# Altium schematic sheet FPGA.SchDoc
size A3; SheetNumber: 2; SheetTotal: 7
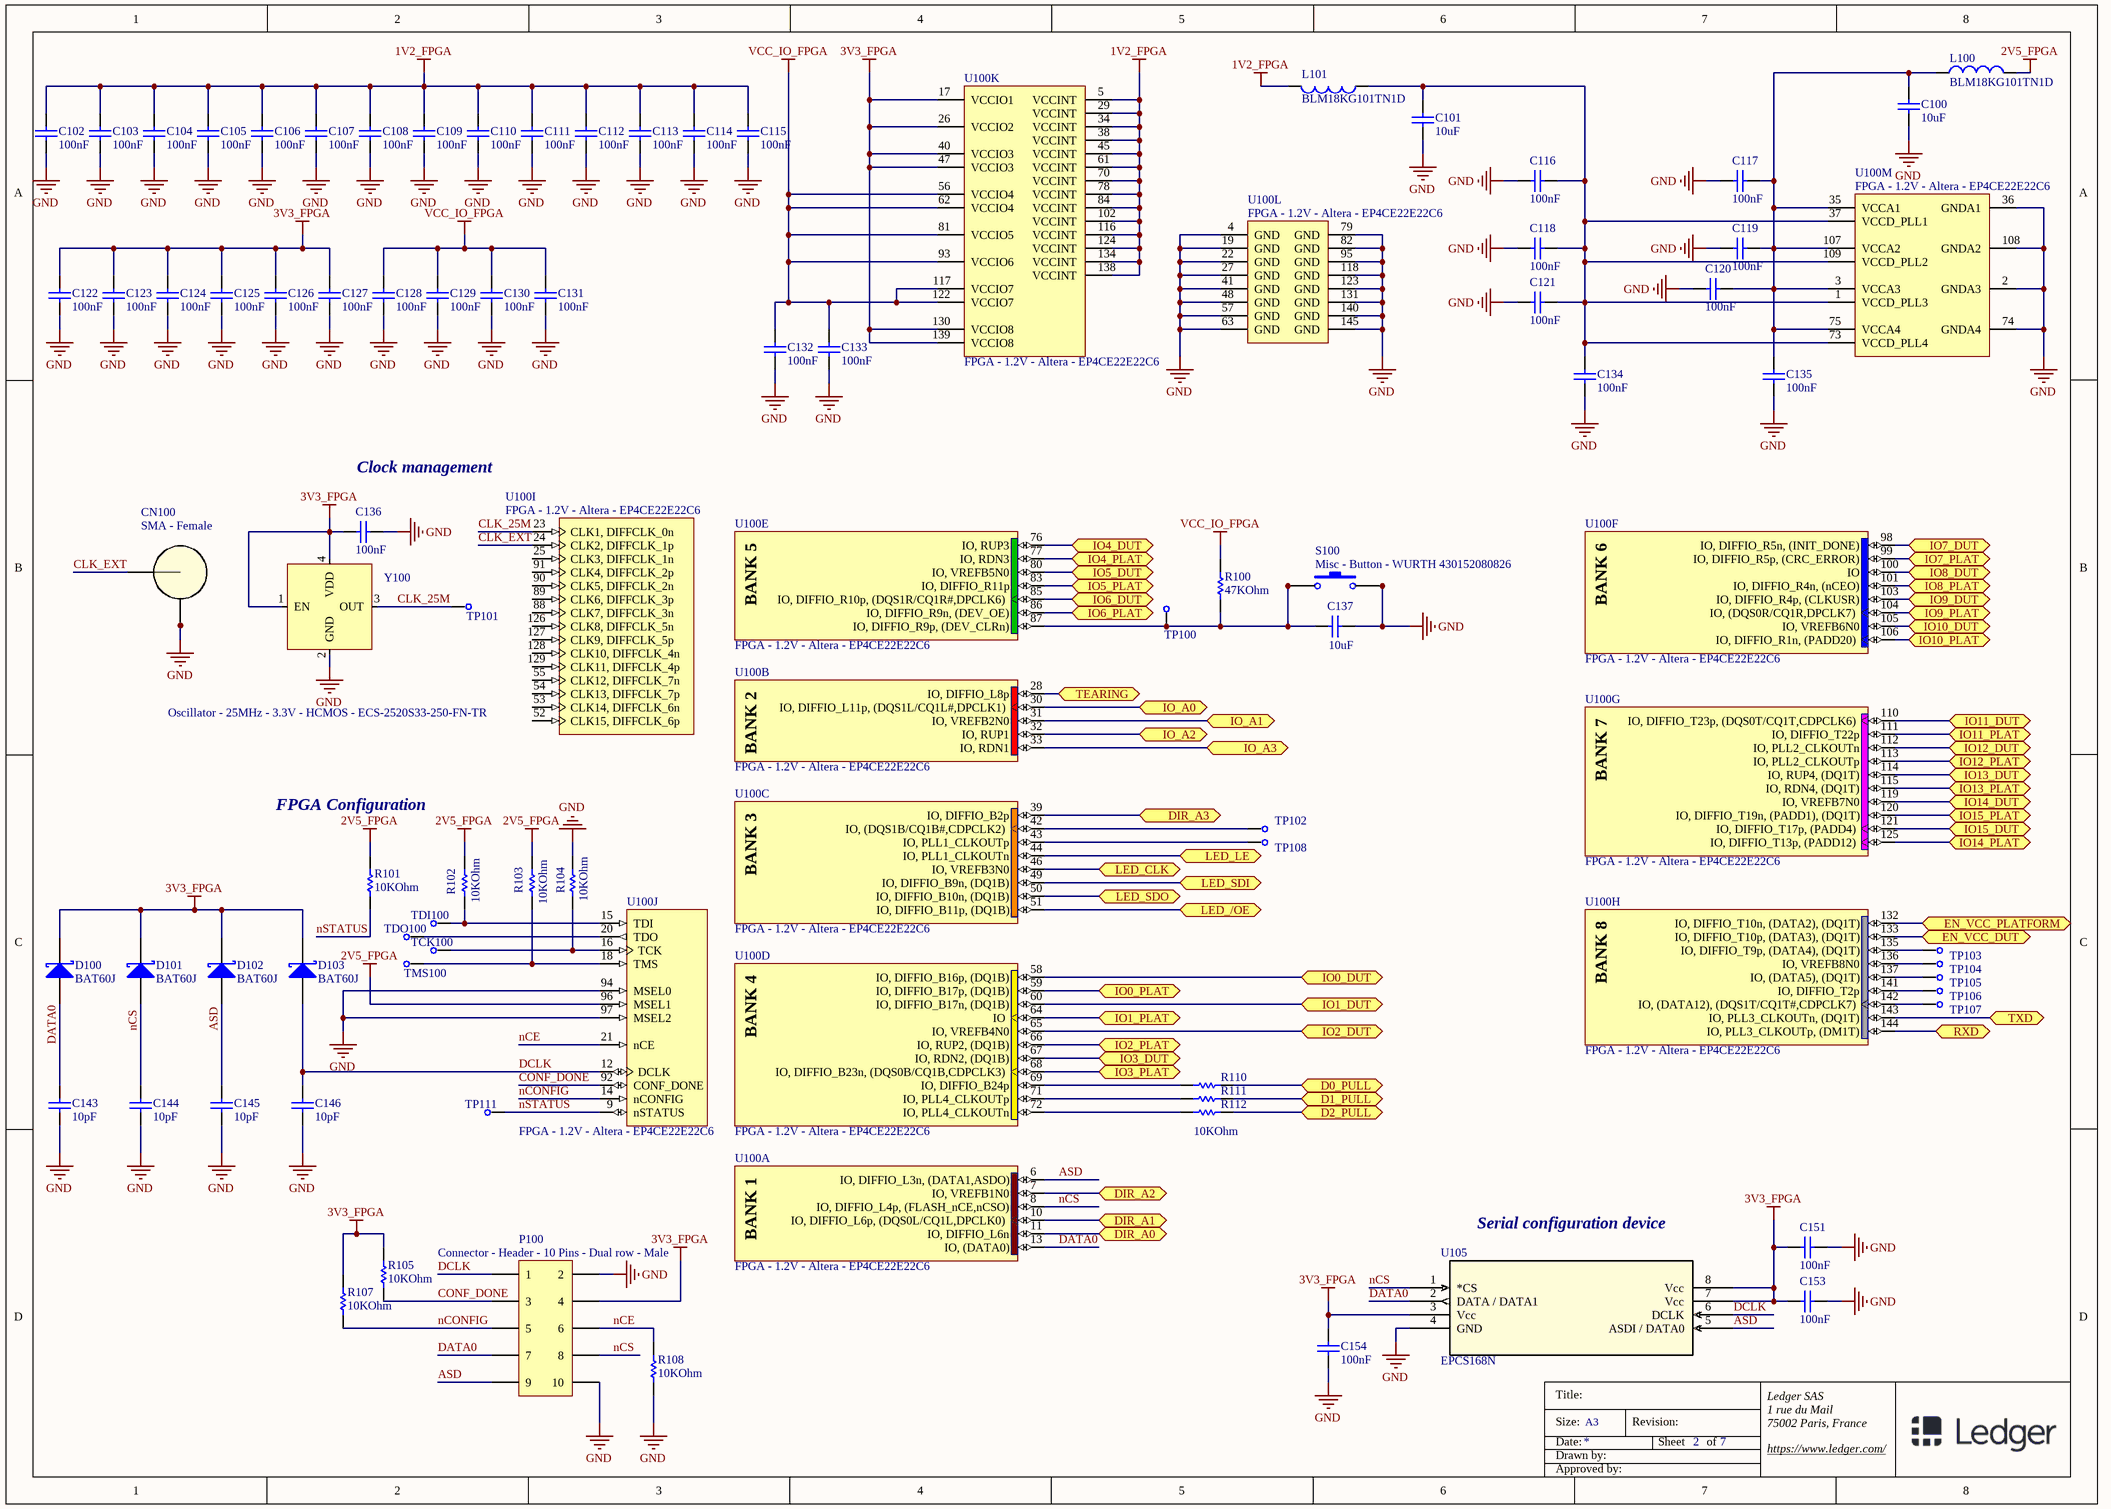
[diagram p0: FPGA.SchDoc]

## Parts
C100  10uF  [CAP0603]
C101  10uF  [CAP0603]
C102  100nF  [CAP0603]
C103  100nF  [CAP0603]
C104  100nF  [CAP0603]
C105  100nF  [CAP0603]
C106  100nF  [CAP0603]
C107  100nF  [CAP0603]
C108  100nF  [CAP0603]
C109  100nF  [CAP0603]
C110  100nF  [CAP0603]
C111  100nF  [CAP0603]
C112  100nF  [CAP0603]
C113  100nF  [CAP0603]
C114  100nF  [CAP0603]
C115  100nF  [CAP0603]
C116  100nF  [CAP0603]
C117  100nF  [CAP0603]
C118  100nF  [CAP0603]
C119  100nF  [CAP0603]
C120  100nF  [CAP0603]
C121  100nF  [CAP0603]
C122  100nF  [CAP0603]
C123  100nF  [CAP0603]
C124  100nF  [CAP0603]
C125  100nF  [CAP0603]
C126  100nF  [CAP0603]
C127  100nF  [CAP0603]
C128  100nF  [CAP0603]
C129  100nF  [CAP0603]
C130  100nF  [CAP0603]
C131  100nF  [CAP0603]
C132  100nF  [CAP0603]
C133  100nF  [CAP0603]
C134  100nF  [CAP0603]
C135  100nF  [CAP0603]
C136  100nF  [CAP0603]
C137  10uF  [CAP0603]
C143  10pF  [CAP0603]
C144  10pF  [CAP0603]
C145  10pF  [CAP0603]
C146  10pF  [CAP0603]
C151  100nF  [CAP0603]
C153  100nF  [CAP0603]
C154  100nF  [CAP0603]
CN100  SMA - Female  [SAMTEC_SMA-J-P-X-ST-EM3]
D100  BAT60J  [SOD323/A]
D101  BAT60J  [SOD323/A]
D102  BAT60J  [SOD323/A]
D103  BAT60J  [SOD323/A]
L100  BLM18KG101TN1D  [0603]
L101  BLM18KG101TN1D  [0603]
P100  Connector - Header - 10 Pins - Dual row - Male  [SAMTEC_TSW-105-07-G-D]
R100  47KOhm  [RES0603]
R101  10KOhm  [RES0603]
R102  10KOhm  [RES0603]
R103  10KOhm  [RES0603]
R104  10KOhm  [RES0603]
R105  10KOhm  [RES0603]
R107  10KOhm  [RES0603]
R108  10KOhm  [RES0603]
R110  10KOhm  [RES0603]  (value not drawn)
R111  10KOhm  [RES0603]  (value not drawn)
R112  10KOhm  [RES0603]
S100  Misc - Button - WURTH 430152080826  [430152080826]
TCK100  (no value)  [TP_001]  (no BOM)
TDI100  (no value)  [TP_001]  (no BOM)
TDO100  (no value)  [TP_001]  (no BOM)
TMS100  (no value)  [TP_001]  (no BOM)
TP100  (no value)  [TP_001]  (no BOM)
TP101  (no value)  [TP_001]  (no BOM)
TP102  (no value)  [TP_001]  (no BOM)
TP103  (no value)  [TP_001]  (no BOM)
TP104  (no value)  [TP_001]  (no BOM)
TP105  (no value)  [TP_001]  (no BOM)
TP106  (no value)  [TP_001]  (no BOM)
TP107  (no value)  [TP_001]  (no BOM)
TP108  (no value)  [TP_001]  (no BOM)
TP111  (no value)  [TP_001]  (no BOM)
U100  FPGA - 1.2V - Altera - EP4CE22E22C6  [EQFP144_M]  (parts A,B,C,D,E,F,G,H,I,J,K,L,M of 13)
U105  EPCS168N  [8-SOIC-M]
Y100  Oscillator - 25MHz - 3.3V - HCMOS - ECS-2520S33-250-FN-TR  [XTAL_2520]

## Ports
D0_PULL, D1_PULL, D2_PULL, DIR_A0, DIR_A1, DIR_A2, DIR_A3, EN_VCC_DUT, EN_VCC_PLATFORM, IO0_DUT, IO0_PLAT, IO1_DUT, IO1_PLAT, IO2_DUT, IO2_PLAT, IO3_DUT, IO3_PLAT, IO4_DUT, IO4_PLAT, IO5_DUT, IO5_PLAT, IO6_DUT, IO6_PLAT, IO7_DUT, IO7_PLAT, IO8_DUT, IO8_PLAT, IO9_DUT, IO9_PLAT, IO10_DUT, IO10_PLAT, IO11_DUT, IO11_PLAT, IO12_DUT, IO12_PLAT, IO13_DUT, IO13_PLAT, IO14_DUT, IO14_PLAT, IO15_DUT, IO15_PLAT, IO_A0, IO_A1, IO_A2, IO_A3, LED_/OE, LED_CLK, LED_LE, LED_SDI, LED_SDO, RXD, TEARING, TXD

## Nets
1V2_FPGA: C102.2 C103.2 C104.2 C105.2 C106.2 C107.2 C108.2 C109.2 C110.2 C111.2 C112.2 C113.2 C114.2 C115.2 L101.2 U100.5(VCCINT) U100.29(VCCINT) U100.34(VCCINT) U100.38(VCCINT) U100.45(VCCINT) U100.61(VCCINT) U100.70(VCCINT) U100.78(VCCINT) U100.84(VCCINT) U100.102(VCCINT) U100.116(VCCINT) U100.124(VCCINT) U100.134(VCCINT) U100.138(VCCINT)
2V5_FPGA: L100.2 R101.2 R102.2 R103.2 U100.96(MSEL1)
3V3_FPGA: C122.2 C123.2 C124.2 C125.2 C126.2 C127.2 C136.1 C151.2 C153.2 C154.2 D100.2(K) D101.2(K) D102.2(K) D103.2(K) P100.4 R105.2 R107.2 U100.17(VCCIO1) U100.26(VCCIO2) U100.40(VCCIO3) U100.47(VCCIO3) U100.130(VCCIO8) U100.139(VCCIO8) U105.3(Vcc) U105.7(Vcc) U105.8(Vcc) Y100.1(EN) Y100.4(VDD)
GND: C100.1 C101.1 C102.1 C103.1 C104.1 C105.1 C106.1 C107.1 C108.1 C109.1 C110.1 C111.1 C112.1 C113.1 C114.1 C115.1 C116.1 C117.1 C118.1 C119.1 C120.1 C121.1 C122.1 C123.1 C124.1 C125.1 C126.1 C127.1 C128.1 C129.1 C130.1 C131.1 C132.1 C133.1 C134.1 C135.1 C136.2 C137.1 C143.1 C144.1 C145.1 C146.1 C151.1 C153.1 C154.1 CN100.2 CN100.3 P100.2 P100.10 R104.2 R108.1 S100.2 S100.4 U100.2(GNDA3) U100.4(GND) U100.19(GND) U100.22(GND) U100.27(GND) U100.36(GNDA1) U100.41(GND) U100.48(GND) U100.57(GND) U100.63(GND) U100.74(GNDA4) U100.79(GND) U100.82(GND) U100.94(MSEL0) U100.95(GND) U100.97(MSEL2) U100.108(GNDA2) U100.118(GND) U100.123(GND) U100.131(GND) U100.140(GND) U100.145(GND) U105.4(GND) Y100.2(GND)
VCC_IO_FPGA: C128.2 C129.2 C130.2 C131.2 C132.2 C133.2 R100.2 U100.56(VCCIO4) U100.62(VCCIO4) U100.81(VCCIO5) U100.93(VCCIO6) U100.117(VCCIO7) U100.122(VCCIO7)
ASD: C145.2 D102.1(A) P100.9 U100.6(IO,_DIFFIO_L3n,_(DATA1,ASDO)) U105.5(ASDI_/_DATA0)
CLK_25M: TP101.1 U100.23(CLK1,_DIFFCLK_0n) Y100.3(OUT)
CLK_EXT: CN100.1 U100.24(CLK2,_DIFFCLK_1p)
CONF_DONE: P100.3 R105.1 U100.92(CONF_DONE)
D0_PULL: R110.2 ; port D0_PULL
D1_PULL: R111.2 ; port D1_PULL
D2_PULL: R112.1 ; port D2_PULL
DATA0: C143.2 D100.1(A) P100.7 U100.13(IO,_(DATA0)) U105.2(DATA_/_DATA1)
DCLK: C146.2 D103.1(A) P100.1 U100.12(DCLK) U105.6(DCLK)
DIR_A0: U100.11(IO,_DIFFIO_L6n) ; port DIR_A0
DIR_A1: U100.10(IO,_DIFFIO_L6p,_(DQS0L/CQ1L,DPCLK0)) ; port DIR_A1
DIR_A2: U100.7(IO,_VREFB1N0) ; port DIR_A2
DIR_A3: U100.39(IO,_DIFFIO_B2p) ; port DIR_A3
EN_VCC_DUT: U100.133(IO,_DIFFIO_T10p,_(DATA3),_(DQ1T)) ; port EN_VCC_DUT
EN_VCC_PLATFORM: U100.132(IO,_DIFFIO_T10n,_(DATA2),_(DQ1T)) ; port EN_VCC_PLATFORM
IO0_DUT: U100.58(IO,_DIFFIO_B16p,_(DQ1B)) ; port IO0_DUT
IO0_PLAT: U100.59(IO,_DIFFIO_B17p,_(DQ1B)) ; port IO0_PLAT
IO1_DUT: U100.60(IO,_DIFFIO_B17n,_(DQ1B)) ; port IO1_DUT
IO1_PLAT: U100.64(IO) ; port IO1_PLAT
IO2_DUT: U100.65(IO,_VREFB4N0) ; port IO2_DUT
IO2_PLAT: U100.66(IO,_RUP2,_(DQ1B)) ; port IO2_PLAT
IO3_DUT: U100.67(IO,_RDN2,_(DQ1B)) ; port IO3_DUT
IO3_PLAT: U100.68(IO,_DIFFIO_B23n,_(DQS0B/CQ1B,CDPCLK3)) ; port IO3_PLAT
IO4_DUT: U100.76(IO,_RUP3) ; port IO4_DUT
IO4_PLAT: U100.77(IO,_RDN3) ; port IO4_PLAT
IO5_DUT: U100.80(IO,_VREFB5N0) ; port IO5_DUT
IO5_PLAT: U100.83(IO,_DIFFIO_R11p) ; port IO5_PLAT
IO6_DUT: U100.85(IO,_DIFFIO_R10p,_(DQS1R/CQ1R#,DPCLK6)) ; port IO6_DUT
IO6_PLAT: U100.86(IO,_DIFFIO_R9n,_(DEV_OE)) ; port IO6_PLAT
IO7_DUT: U100.98(IO,_DIFFIO_R5n,_(INIT_DONE)) ; port IO7_DUT
IO7_PLAT: U100.99(IO,_DIFFIO_R5p,_(CRC_ERROR)) ; port IO7_PLAT
IO8_DUT: U100.100(IO) ; port IO8_DUT
IO8_PLAT: U100.101(IO,_DIFFIO_R4n,_(nCEO)) ; port IO8_PLAT
IO9_DUT: U100.103(IO,_DIFFIO_R4p,_(CLKUSR)) ; port IO9_DUT
IO9_PLAT: U100.104(IO,_(DQS0R/CQ1R,DPCLK7)) ; port IO9_PLAT
IO10_DUT: U100.105(IO,_VREFB6N0) ; port IO10_DUT
IO10_PLAT: U100.106(IO,_DIFFIO_R1n,_(PADD20)) ; port IO10_PLAT
IO11_DUT: U100.110(IO,_DIFFIO_T23p,_(DQS0T/CQ1T,CDPCLK6)) ; port IO11_DUT
IO11_PLAT: U100.111(IO,_DIFFIO_T22p) ; port IO11_PLAT
IO12_DUT: U100.112(IO,_PLL2_CLKOUTn) ; port IO12_DUT
IO12_PLAT: U100.113(IO,_PLL2_CLKOUTp) ; port IO12_PLAT
IO13_DUT: U100.114(IO,_RUP4,_(DQ1T)) ; port IO13_DUT
IO13_PLAT: U100.115(IO,_RDN4,_(DQ1T)) ; port IO13_PLAT
IO14_DUT: U100.119(IO,_VREFB7N0) ; port IO14_DUT
IO14_PLAT: U100.125(IO,_DIFFIO_T13p,_(PADD12)) ; port IO14_PLAT
IO15_DUT: U100.121(IO,_DIFFIO_T17p,_(PADD4)) ; port IO15_DUT
IO15_PLAT: U100.120(IO,_DIFFIO_T19n,_(PADD1),_(DQ1T)) ; port IO15_PLAT
IO_A0: U100.30(IO,_DIFFIO_L11p,_(DQS1L/CQ1L#,DPCLK1)) ; port IO_A0
IO_A1: U100.31(IO,_VREFB2N0) ; port IO_A1
IO_A2: U100.32(IO,_RUP1) ; port IO_A2
IO_A3: U100.33(IO,_RDN1) ; port IO_A3
LED_/OE: U100.51(IO,_DIFFIO_B11p,_(DQ1B)) ; port LED_/OE
LED_CLK: U100.46(IO,_VREFB3N0) ; port LED_CLK
LED_LE: U100.44(IO,_PLL1_CLKOUTn) ; port LED_LE
LED_SDI: U100.49(IO,_DIFFIO_B9n,_(DQ1B)) ; port LED_SDI
LED_SDO: U100.50(IO,_DIFFIO_B10n,_(DQ1B)) ; port LED_SDO
nCE: P100.6 R108.2 U100.21(nCE)
nCONFIG: P100.5 R107.1 U100.14(nCONFIG)
nCS: C144.2 D101.1(A) P100.8 U100.8(IO,_DIFFIO_L4p,_(FLASH_nCE,nCSO)) U105.1(*CS)
nSTATUS: R101.1 TP111.1 U100.9(nSTATUS)
RXD: U100.144(IO,_PLL3_CLKOUTp,_(DM1T)) ; port RXD
TEARING: U100.28(IO,_DIFFIO_L8p) ; port TEARING
TXD: U100.143(IO,_PLL3_CLKOUTn,_(DQ1T)) ; port TXD
NetC100_2: C100.2 C117.2 C119.2 C120.2 C135.2 L100.1 U100.3(VCCA3) U100.35(VCCA1) U100.75(VCCA4) U100.107(VCCA2)
NetC101_2: C101.2 C116.2 C118.2 C121.2 C134.2 L101.1 U100.1(VCCD_PLL3) U100.37(VCCD_PLL1) U100.73(VCCD_PLL4) U100.109(VCCD_PLL2)
NetC137_2: C137.2 R100.1 S100.1 S100.3 TP100.1 U100.87(IO,_DIFFIO_R9p,_(DEV_CLRn))
NetR102_1: R102.1 TDI100.1 U100.15(TDI)
NetR103_1: R103.1 TMS100.1 U100.18(TMS)
NetR104_1: R104.1 TCK100.1 U100.16(TCK)
NetR110_1: R110.1 U100.69(IO,_DIFFIO_B24p)
NetR111_1: R111.1 U100.71(IO,_PLL4_CLKOUTp)
NetR112_2: R112.2 U100.72(IO,_PLL4_CLKOUTn)
NetTDO100_1: TDO100.1 U100.20(TDO)
NetTP102_1: TP102.1 U100.42(IO,_(DQS1B/CQ1B#,CDPCLK2))
NetTP103_1: TP103.1 U100.135(IO,_DIFFIO_T9p,_(DATA4),_(DQ1T))
NetTP104_1: TP104.1 U100.136(IO,_VREFB8N0)
NetTP105_1: TP105.1 U100.137(IO,_(DATA5),_(DQ1T))
NetTP106_1: TP106.1 U100.141(IO,_DIFFIO_T2p)
NetTP107_1: TP107.1 U100.142(IO,_(DATA12),_(DQS1T/CQ1T#,CDPCLK7))
NetTP108_1: TP108.1 U100.43(IO,_PLL1_CLKOUTp)

Not connected (* = marked no-connect by the designer): U100 25(CLK3,_DIFFCLK_1n) 52(CLK15,_DIFFCLK_6p) 53(CLK14,_DIFFCLK_6n) 54(CLK13,_DIFFCLK_7p) 55(CLK12,_DIFFCLK_7n) 88(CLK7,_DIFFCLK_3n) 89(CLK6,_DIFFCLK_3p) 90(CLK5,_DIFFCLK_2n) 91(CLK4,_DIFFCLK_2p) 126(CLK8,_DIFFCLK_5n) 127(CLK9,_DIFFCLK_5p) 128(CLK10,_DIFFCLK_4n) 129(CLK11,_DIFFCLK_4p)

## Notes on the sheet
- Clock management
- FPGA Configuration
- Serial configuration device
- Title:
- Size:
- Date:
- Drawn by:
- A3
- Revision:
- Sheet
- of
- Ledger SAS
- 1 rue du Mail
- 75002 Paris, France
- https://www.ledger.com/
- Approved by:
- (in symbol FPGA - 1.2V - Altera - EP4CE22E22C6, part A) BANK 1
- (in symbol FPGA - 1.2V - Altera - EP4CE22E22C6, part B) BANK 2
- (in symbol FPGA - 1.2V - Altera - EP4CE22E22C6, part C) BANK 3
- (in symbol FPGA - 1.2V - Altera - EP4CE22E22C6, part D) BANK 4
- (in symbol FPGA - 1.2V - Altera - EP4CE22E22C6, part E) BANK 5
- (in symbol FPGA - 1.2V - Altera - EP4CE22E22C6, part F) BANK 6
- (in symbol FPGA - 1.2V - Altera - EP4CE22E22C6, part G) BANK 7
- (in symbol FPGA - 1.2V - Altera - EP4CE22E22C6, part H) BANK 8

## Library data of the parts
C100 C101 C137 = Capacitor 0603 - 10uF - 16V - X5R - 20%: Manufacturer: Murata; Manufacturer PN: GRM188R61C106MA73D; Manufacturer1: TDK; Manufacturer1 PN: C1608X5R1C106M080AB; Manufacturer2 PN: EMK107BBJ106MA-T; PkgCode: 0603; value: 10uF; Type: X5R; Tolerance: 20%; Power: 16V; Manufacturer2: Taiyo Yuden
C102-C135 C151 C153 C154 = Capacitor 0603 - 100nF - 16V - X7R - 10%: Manufacturer2 PN: MCCA000159; Manufacturer1: Yageo; Manufacturer1 PN: CC0603KRX7R7BB104; Manufacturer: Wurth; Manufacturer PN: 885012206046; PkgCode: 0603; Manufacturer2: Multicomp; Value: 100nF; Power: 16V; Tolerance: 10%; Type: X7R
C136 = Capacitor 0603 - 100nF - 16V - X7R - 10%: Manufacturer: Wurth; Manufacturer PN: 885012206046; Manufacturer1: Yageo; Manufacturer1 PN: CC0603KRX7R7BB104; Manufacturer2 PN: MCCA000159; PkgCode: 0603; Value: 100nF; Power: 16V; Tolerance: 10%; Type: X7R; Manufacturer2: Multicomp
C143-C146 = Capacitor 0603 -  10pF - 100V - COG - 5%: Manufacturer: TDK; Manufacturer PN: C1608C0G2A100D; Manufacturer1: Murata; Manufacturer1 PN: GCM1885C2A100J; Manufacturer2 PN: CL10C100JC81PB; PkgCode: 0603; Value: 10pF; Power: 100V; Tolerance: 5%; Type: COG; Manufacturer2: Samsung
CN100 = Connector - SMA - Female - Horizontal - Mid Mount - Samtec - SMA–J–P–H–ST–EM3: pin to pad: 1>S1 2>G1 3>G2; Impedance: 50 Ohms; Manufacturer: Samtec; Manufacturer PN: SMA–J–P–H–ST–EM3; Type: SMA; Gender: Female
D100-D103 = Diode -Schottky -10V - 3 A - SOD−323 - BAT60J: Manufacturer: STMicroelectronics; Power: 310mW; PgkCode: SOD-323; Manufacturer PN: BAT60J
L100 L101 = Ferrite - Bead - 0603 BLM18: Manufacturer: MURATA; Impedance: 100Ohms; Rated Current: 1 A; DC Resistance: 30 mOhms; Manufacturer PN: BLM18KG101TN1D; Pkgref: 0603
P100 = Connector - Header - 10 Pins - Dual row - Male: Manufacturer: Samtec; Manufacturer PN: TSW-105-07-G-D; NoPins: 10; Rows: 2
R100 = Resistor 0603 -   47KOhm - 1/10W - 1%: Manufacturer PN: RC0603FR-0747KL; Manufacturer: YAGEO; PkgCode: 0603; Value: 47KOhm; Tolerance: 1%; Power: 1/10W
R101-R105 R107 R108 R110-R112 = Resistor 0603 -    10KOhm - 1/10W - 1%: Manufacturer: Yageo; Manufacturer PN: RC0603FR-0710KL; Manufacturer1: Panasonic; Manufacturer1 PN: ERJ3EKF1002; Manufacturer2 PN: RK73H1JHT..1002F; PkgCode: 0603; Value: 10KOhm; Tolerance: 1%; Power: 1/10W; Manufacturer2: KOA Speer
S100 = Misc - Button - WURTH 430152080826: Manufacturer: Wurth Elektronik; Rated Current: 50 mA; Operation Force: 260 gf; Rated Voltage: 12 VDC; Manufacturer PN: 430152080826; Size: 6x6x8 mm
TCK100 TDI100 TDO100 TMS100 TP100-TP108 TP111 = Misc - Test point CMS
U100 = FPGA - 1.2V - Altera - EP4CE22E22C6: PkgRef: EQFP144; Manufacturer PN: EP4CE22E22C6; Manufacturer: Altera
U105 = IC - Serial configuration device - 16Mbits - SOIC8 - Altera - EPCS168N: Manufacturer: Altera / Intel; Manufacturer PN: EPCS16SI8N; Manufacturer1 PN: EPCQ16ASI8N; Manufacturer1: Altera / Intel
Y100 = Oscillator - 25MHz - 3.3V - HCMOS - ECS-2520S33-250-FN-TR: Manufacturer: ECS; Manufacturer PN: ECS-2520S33-250-FN-TR